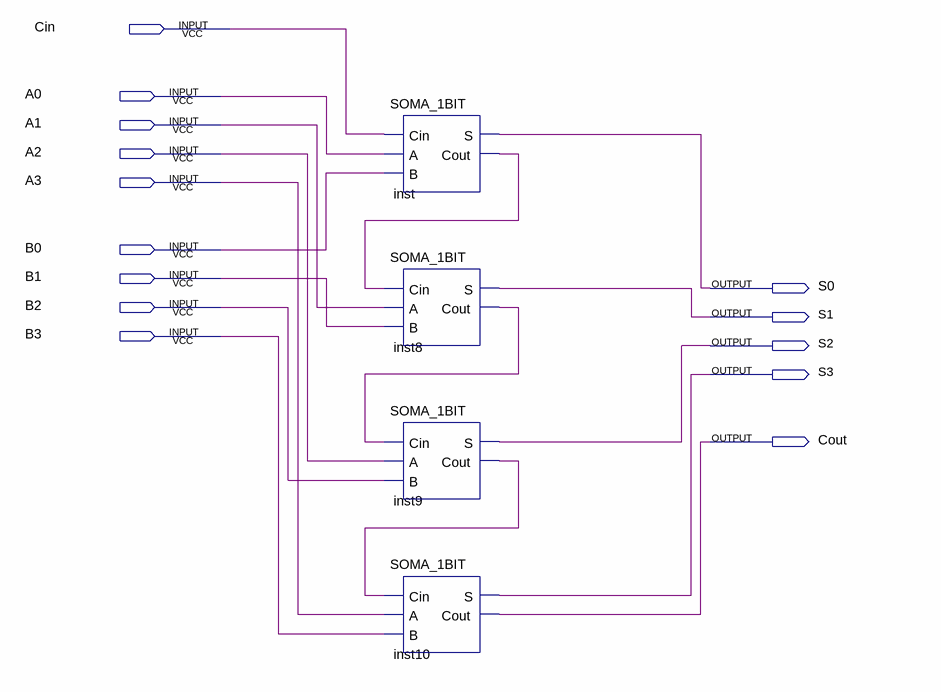
[diagram p0: schematic sheet]
// Quartus schematic SOMADOR_4BITS.bdf as structural Verilog: 4 symbols, 14 pins
module SOMADOR_4BITS (
  input  Cin,
  input  A0,
  input  A1,
  input  A2,
  input  A3,
  input  B0,
  input  B1,
  input  B2,
  input  B3,
  output S0,
  output S1,
  output S2,
  output S3,
  output Cout
);

  wire inst8_cout, inst9_cout, inst_cout;

  SOMA_1BIT inst (.Cin(Cin), .A(A0), .B(B0), .S(S0), .Cout(inst_cout));
  SOMA_1BIT inst8 (.Cin(inst_cout), .A(A1), .B(B1), .S(S1), .Cout(inst8_cout));
  SOMA_1BIT inst9 (.Cin(inst8_cout), .A(A2), .B(B2), .S(S2), .Cout(inst9_cout));
  SOMA_1BIT inst10 (.Cin(inst9_cout), .A(A3), .B(B3), .S(S3), .Cout(Cout));
endmodule
